# Altium schematic sheet LED_Chaser.SchDoc
size A4; SheetNumber: 1; SheetTotal: 1
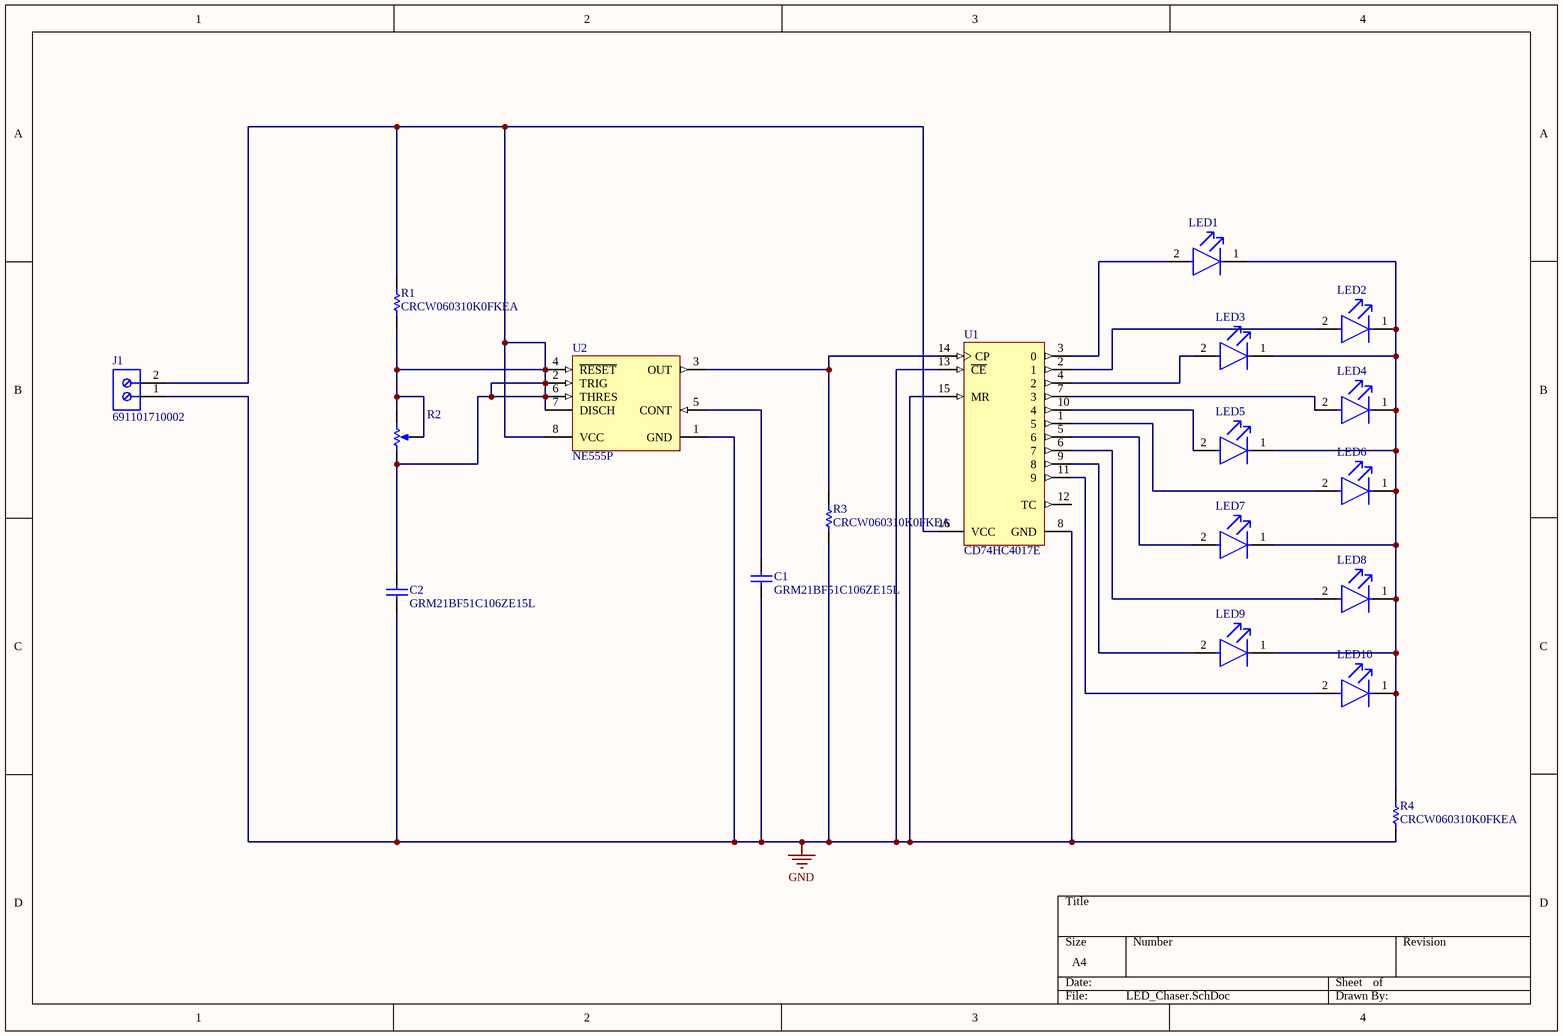
[diagram p0: LED_Chaser.SchDoc]

## Parts
C1  GRM21BF51C106ZE15L  [CAPC2013X135X45NL10T25]
C2  GRM21BF51C106ZE15L  [CAPC2013X135X45NL10T25]
J1  691101710002  [691101710002]
LED1  (no value)  [FP-LTST-C190GKT-MFG]
LED2  (no value)  [FP-LTST-C190GKT-MFG]
LED3  (no value)  [FP-LTST-C190GKT-MFG]
LED4  (no value)  [FP-LTST-C190GKT-MFG]
LED5  (no value)  [FP-LTST-C190GKT-MFG]
LED6  (no value)  [FP-LTST-C190GKT-MFG]
LED7  (no value)  [FP-LTST-C190GKT-MFG]
LED8  (no value)  [FP-LTST-C190GKT-MFG]
LED9  (no value)  [FP-LTST-C190GKT-MFG]
LED10  (no value)  [FP-LTST-C190GKT-MFG]
R1  CRCW060310K0FKEA  [RESC1609X50X30NL8T20]
R2  Potentiometer  (value not drawn)
R3  CRCW060310K0FKEA  [RESC1609X50X30NL8T20]
R4  CRCW060310K0FKEA  [RESC1609X50X30NL8T20]
U1  CD74HC4017E  [N0016A]
U2  NE555P  [P0008A]

## Nets
GND: C1.1 C2.1 J1.1 R3.1 R4.1 U1.8(GND) U1.13(~{CE}) U1.15(MR) U2.1(GND)
NetC1_2: C1.2 U2.5(CONT)
NetC2_2: C2.2 J1.2 R1.1 R1.2 R2.1(TOP) R2.2(BOT) R2.3(TAP) U1.16(VCC) U2.2(TRIG) U2.4(~{RESET}) U2.6(THRES) U2.7(DISCH) U2.8(VCC)
NetLED1_1: LED1.1(C) LED2.1(C) LED3.1(C) LED4.1(C) LED5.1(C) LED6.1(C) LED7.1(C) LED8.1(C) LED9.1(C) LED10.1(C) R4.2
NetLED1_2: LED1.2(A) U1.3(0)
NetLED2_2: LED2.2(A) U1.2(1)
NetLED3_2: LED3.2(A) U1.4(2)
NetLED4_2: LED4.2(A) U1.7(3)
NetLED5_2: LED5.2(A) U1.10(4)
NetLED6_2: LED6.2(A) U1.1(5)
NetLED7_2: LED7.2(A) U1.5(6)
NetLED8_2: LED8.2(A) U1.6(7)
NetLED9_2: LED9.2(A) U1.9(8)
NetLED10_2: LED10.2(A) U1.11(9)
NetR3_2: R3.2 U1.14(CP) U2.3(OUT)

Not connected (* = marked no-connect by the designer): U1 12(TC)

## Library data of the parts
C1 C2 = CMP-2007-03514-1: Manufacturer: Murata; Part Number: GRM21BF51C106ZE15L
J1 = CMP-1502-03256-2: NexarPartId: 8917704; Current Rating: 16A; Pitch: 5.0038mm; Stripping Length: -7mm; Plating: Steel; Voltage: 250V; Wire Gauge (Max): 26AWG; Number of Contacts: 2; Number of Levels: 1; Wire Gauge (Min): 14AWG; Number of Pins: 2; Contact Plating: Tin; Max Operating Temperature: 105°C; Contact Material: Brass; Min Operating Temperature: -40°C; Height: 16.4mm; Lead Pitch: 5mm; Length: 9mm; Termination: Screw; Current: 16A; Housing Material: Nylon; Width: 11.2mm; RoHS: Compliant; Voltage Rating: 250V; Number of Positions Per Level: 2; Mount: Through Hole; Color: Blue; Packaging: Box; REACH SVHC: Unknown; Wire/Cable Gauge: 26AWG
LED1-LED10 = CMP-22017-000005-2: LED GREEN CLEAR CHIP SMD; Dominant Wavelength: 569nm; Reverse Voltage: 5V; Lens Color: Colorless; Viewing Angle: 130°; Voltage: 2V; Forward Current: 30mA; Power Dissipation: 100mW; Luminous Intensity: 6mcd; Number of LEDs: 1; Forward Voltage: 2.1V; Wavelength: 565nm; Test Current: 10mA; Min Operating Temperature: -55°C; Lens Style: Clear; Mount: Surface Mount; Width: 0.8mm; Packaging: Tape and Reel; Lens Transparency: Clear; Case Code (Metric): 1608; Depth: 0.8mm; Case Code (Imperial): 0603; Case/Package: 0603; Number of Pins: 2; Max Operating Temperature: 85°C; Lead Free: Lead Free; Number of Elements: 1; Length: 1.6mm; Height: 0.8mm; Package Quantity: 1; Power Rating: 100mW; Radiation Hardening: No; Illumination Color: Green; Color: Green
R1 R3 R4 = CMP-1666-00005-4: Chip Resistor, 10 KOhm, +/- 1%, 100 mW, -55 to 155 degC, 0603 (1608 Metric), RoHS, Tape and Reel; Manufacturer: Vishay Semiconductor; Voltage Rating: 75 V; Max Operating Temperature: 155 degC; PackageDescription: 2-Pin Surface Mount Device, Body 1.575 x 0.85 mm; ComponentLink1Description: Manufacturer URL; RoHSCompliant: true; PackageReference: 0603; REACH SVHC: Unknown; Length: 1.55 mm; DatasheetVersion: 06/2012; Packaging: Tape and Reel; Min Operating Temperature: -55 degC; Mounting Technology: Surface Mount; ComponentLink2URL: https://datasheet.ciiva.com/11809/0900766b80d98afc-11809037.pdf; Height: 0.45 mm; ComponentLink2Description: Datasheet; Package Quantity: 5000; ComponentLink1URL: http://www.vishay.com/
R2 = Potentiometer: value: 50k; position: 0.5; SimulationGenericComponent: True
U1 = CMP-1623-00548-2: High Speed CMOS Logic Decade Counter/Divider with 10 Decoded Outputs, N0016A, TUBE; Manufacturer: Texas Instruments; tpd @ Nom Voltage(Max)(ns): 54; Inputs: 1; Input Type: LVTTL/CMOS; Voltage(Nom)(V): 3.3,5; Schmitt Trigger: No; Output Drive (IOL/IOH)(Max)(mA): 5.2/-5.2; Bits(#): 10; VCC(Max)(V): 6; Technology Family: HC; ICC @ Nom Voltage(Max)(mA): 0.08; Rating: Catalog; F @ Nom Voltage(Max)(Mhz): 28; VCC(Min)(V): 2; Generic Part Number: CD74HC4017; Code_JEDEC: MS-001; DatasheetVersion: SCHS200D; Output Type: CMOS; Type: Decade; Operating Temperature Range(C): -55 to 125; PackageReference: N0016A; Function: Counter
U2 = CMP-2000-04954-1: Precision Timer, 4.5 to 16 V, 0 to 70 degC, 8-Pin DIP, Pb-Free, Tube; Manufacturer: TexasInstruments; Maximum High Level Output Current: -200mA; Number of Internal Timers: 1; Operating Supply Voltage: 5; Maximum Low Level Output Current: 200mA; Rad Hard: No; Packaging: Rail/Tube; Manufacturer URL: http://www.ti.com/; Package Reference: P8; Package Description: 8-Pin Double In-line Package, Body 9.59 x 6.35 mm, Pitch 2.54 mm; Package URL: http://www.ti.com/lit/ml/mpdi001b/mpdi001b.pdf; Type: Standard; Datasheet URL: http://www.ti.com/general/docs/lit/getliterature.tsp?genericPartNumber=NE555&fileType=pdf; Category: Timer; Package: 8PDIP; Datasheet Version: Rev. I, 09/2014